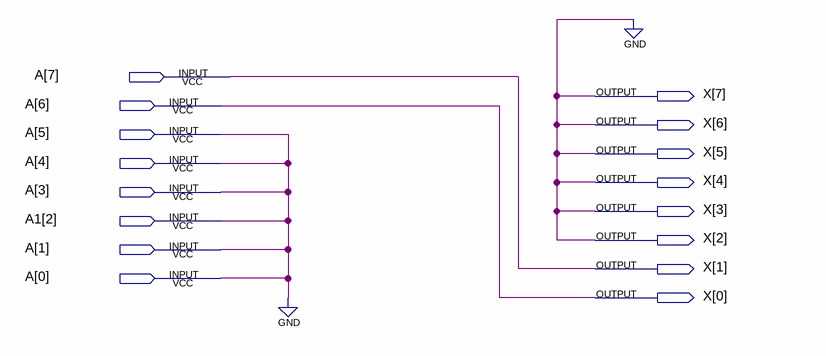
[diagram p0: schematic sheet]
// Quartus schematic CORR6.bdf as structural Verilog: 0 symbols, 16 pins
module CORR6 (
  input  [7:0] A,
  input  [2:2] A1,
  output [7:0] X
);


  assign {A[4:3], A[1:0]} = {4{A[5]}};
  assign A1[2] = A[5];
  assign X = {{6{1'b0}}, A[7:6]};
  // also tied to GND on the sheet: A[5]
endmodule
